# EAGLE design enkoder (EAGLE 9.7.0)
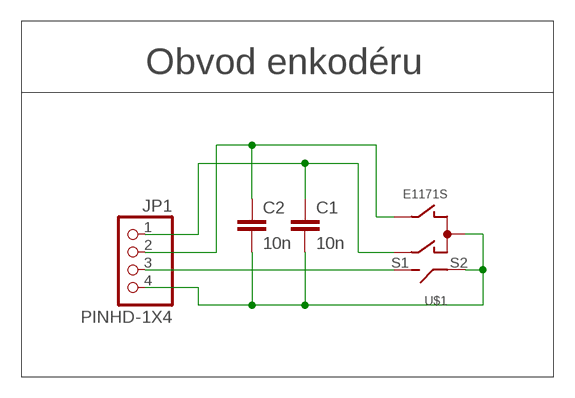
[diagram p0: schematic, sheet 1]

## Parts
C1  10n  C-EUC0805  [C0805]
C2  10n  C-EUC0805  [C0805]
JP1  PINHD-1X4  [1X04]
U$1  E1171S  [E1171S]

## Nets
N$1: C1.2 C2.2 JP1.4 U$1.C U$1.S2
N$2: JP1.3 U$1.S1
N$3: C1.1 JP1.1 U$1.A
N$4: C2.1 JP1.2 U$1.B

## Notes on the sheet
- Obvod enkodéru

## Library data of the parts
C1 C2 = rcl:C-EU: CAPACITOR, European symbol; SPICEPREFIX: C
JP1 = Connector:PINHD-1X4: PIN HEADER; CATEGORY: CONNECTOR; SUB-CATEGORY: PIN-HEADER
U$1 = encoder:E1171S

## Board
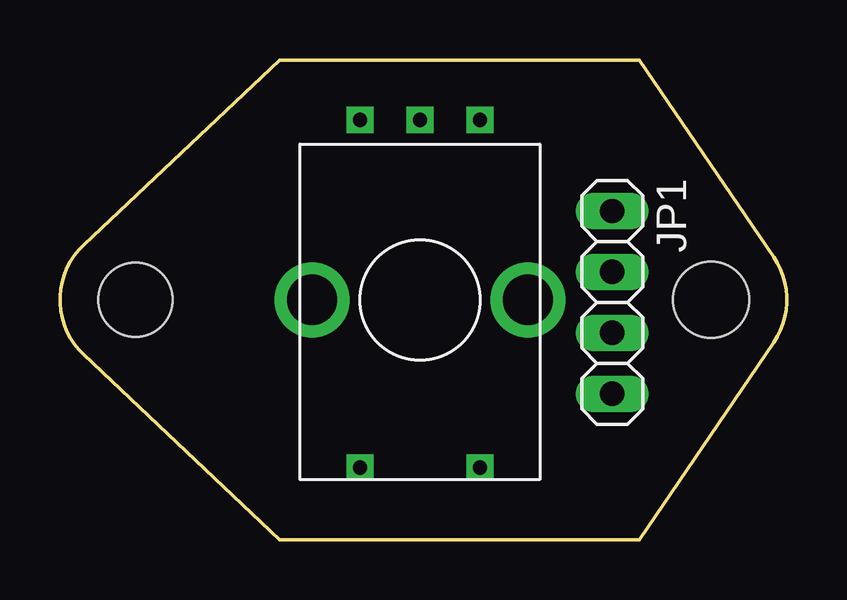
[diagram p1: board, top side]
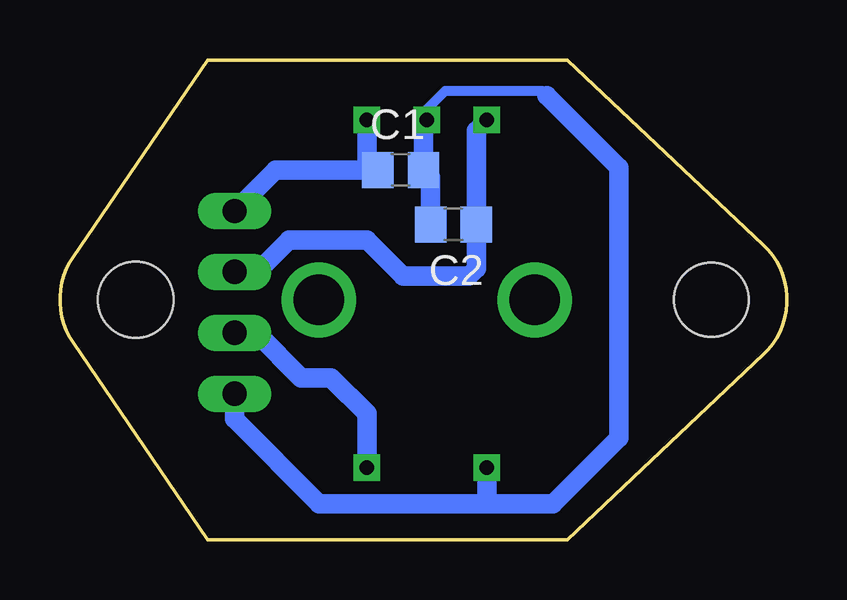
[diagram p2: board, bottom side, seen from below]

Size 30.31 x 20 mm. Coordinates in mm from the lower left corner, seen from the top.
Outline: 9.15,0 24.15,0 29.76,8.22 arc69 29.76,11.78 24.15,20 9.15,20 0.98,12.29 arc93 0.98,7.71 9.15,0
Copper layers (1*16): Top 0.035mm / dielectric 1.5mm / Bottom 0.035mm
Design rules "default": minimum track width 6mil, minimum drill 0.35mm, track to track 6mil, track to pad 6mil, pad to pad 6mil, via to via 6mil, smd to smd 6mil, copper to edge 40mil, drill to drill 6mil, minimum pad ring 10mil, minimum via ring 8mil, stop-mask expansion 4mil, vias tented up to drill 0mil, thermal gap 10mil
Holes 3.1 mm at 3.15,10
Holes 3.16 mm at 27.15,10

### Footprints (pad centres in the part's own frame; a part is rotated, then mirrored left to right if it is on the bottom)
C0805 = smd 1.3 x 1.5: 1 -0.95,0; 2 0.95,0
1X04 = drill 1.016 long: 1 -3.81,0; 2 -1.27,0; 3 1.27,0; 4 3.81,0
E1171S = drill 0.6 square: A -2.5,-7.5; B 2.5,-7.5; C 0,-7.5; S1 -2.5,7; S2 2.5,7 | drill 2.1: P$6 -4.5,0; P$7 4.5,0

### Placement (x,y rotation side)
C1  16.1,15.41 0 bottom
C2  13.9,13.14 180 bottom
JP1  23.03,9.89 270 top
U$1  15.01,9.99 180 top

### Tracks (layer width: path | path; a pad name or v marks a point on that pad's centre or on a via)
N$1
  Bottom 0.406: 15.26,13.55 C2.2 | 10,18.5 10.2,18.7 14.25,18.7 15.15,17.8 15.15,17.35
  Bottom 0.813: 12.75,1.5 9.75,1.5 7,4.25 7,15.5 10,18.5 | C2.2 14.85,15.11 C1.2 15.15,17.35 U$1.C | U$1.S2 12.51,1.74 12.75,1.5 | JP1.4 23.03,5.03 19.5,1.5 12.75,1.5
N$2
  Bottom 0.813: U$1.S1 17.51,5.26 19,6.75 20.25,6.75 22.12,8.62 JP1.3
N$3
  Bottom 0.813: U$1.A 17.51,15.87 C1.1 21.31,15.41 JP1.1
N$4
  Bottom 0.406: U$1.B 12.7,17.3
  Bottom 0.813: JP1.2 22.94,11.25 22,11.25 20.75,12.5 17.5,12.5 16,11 13.25,11 12.95,11.3 C2.1 12.95,17.05 U$1.B